# Altium schematic sheet Sheet1.SchDoc
size A3
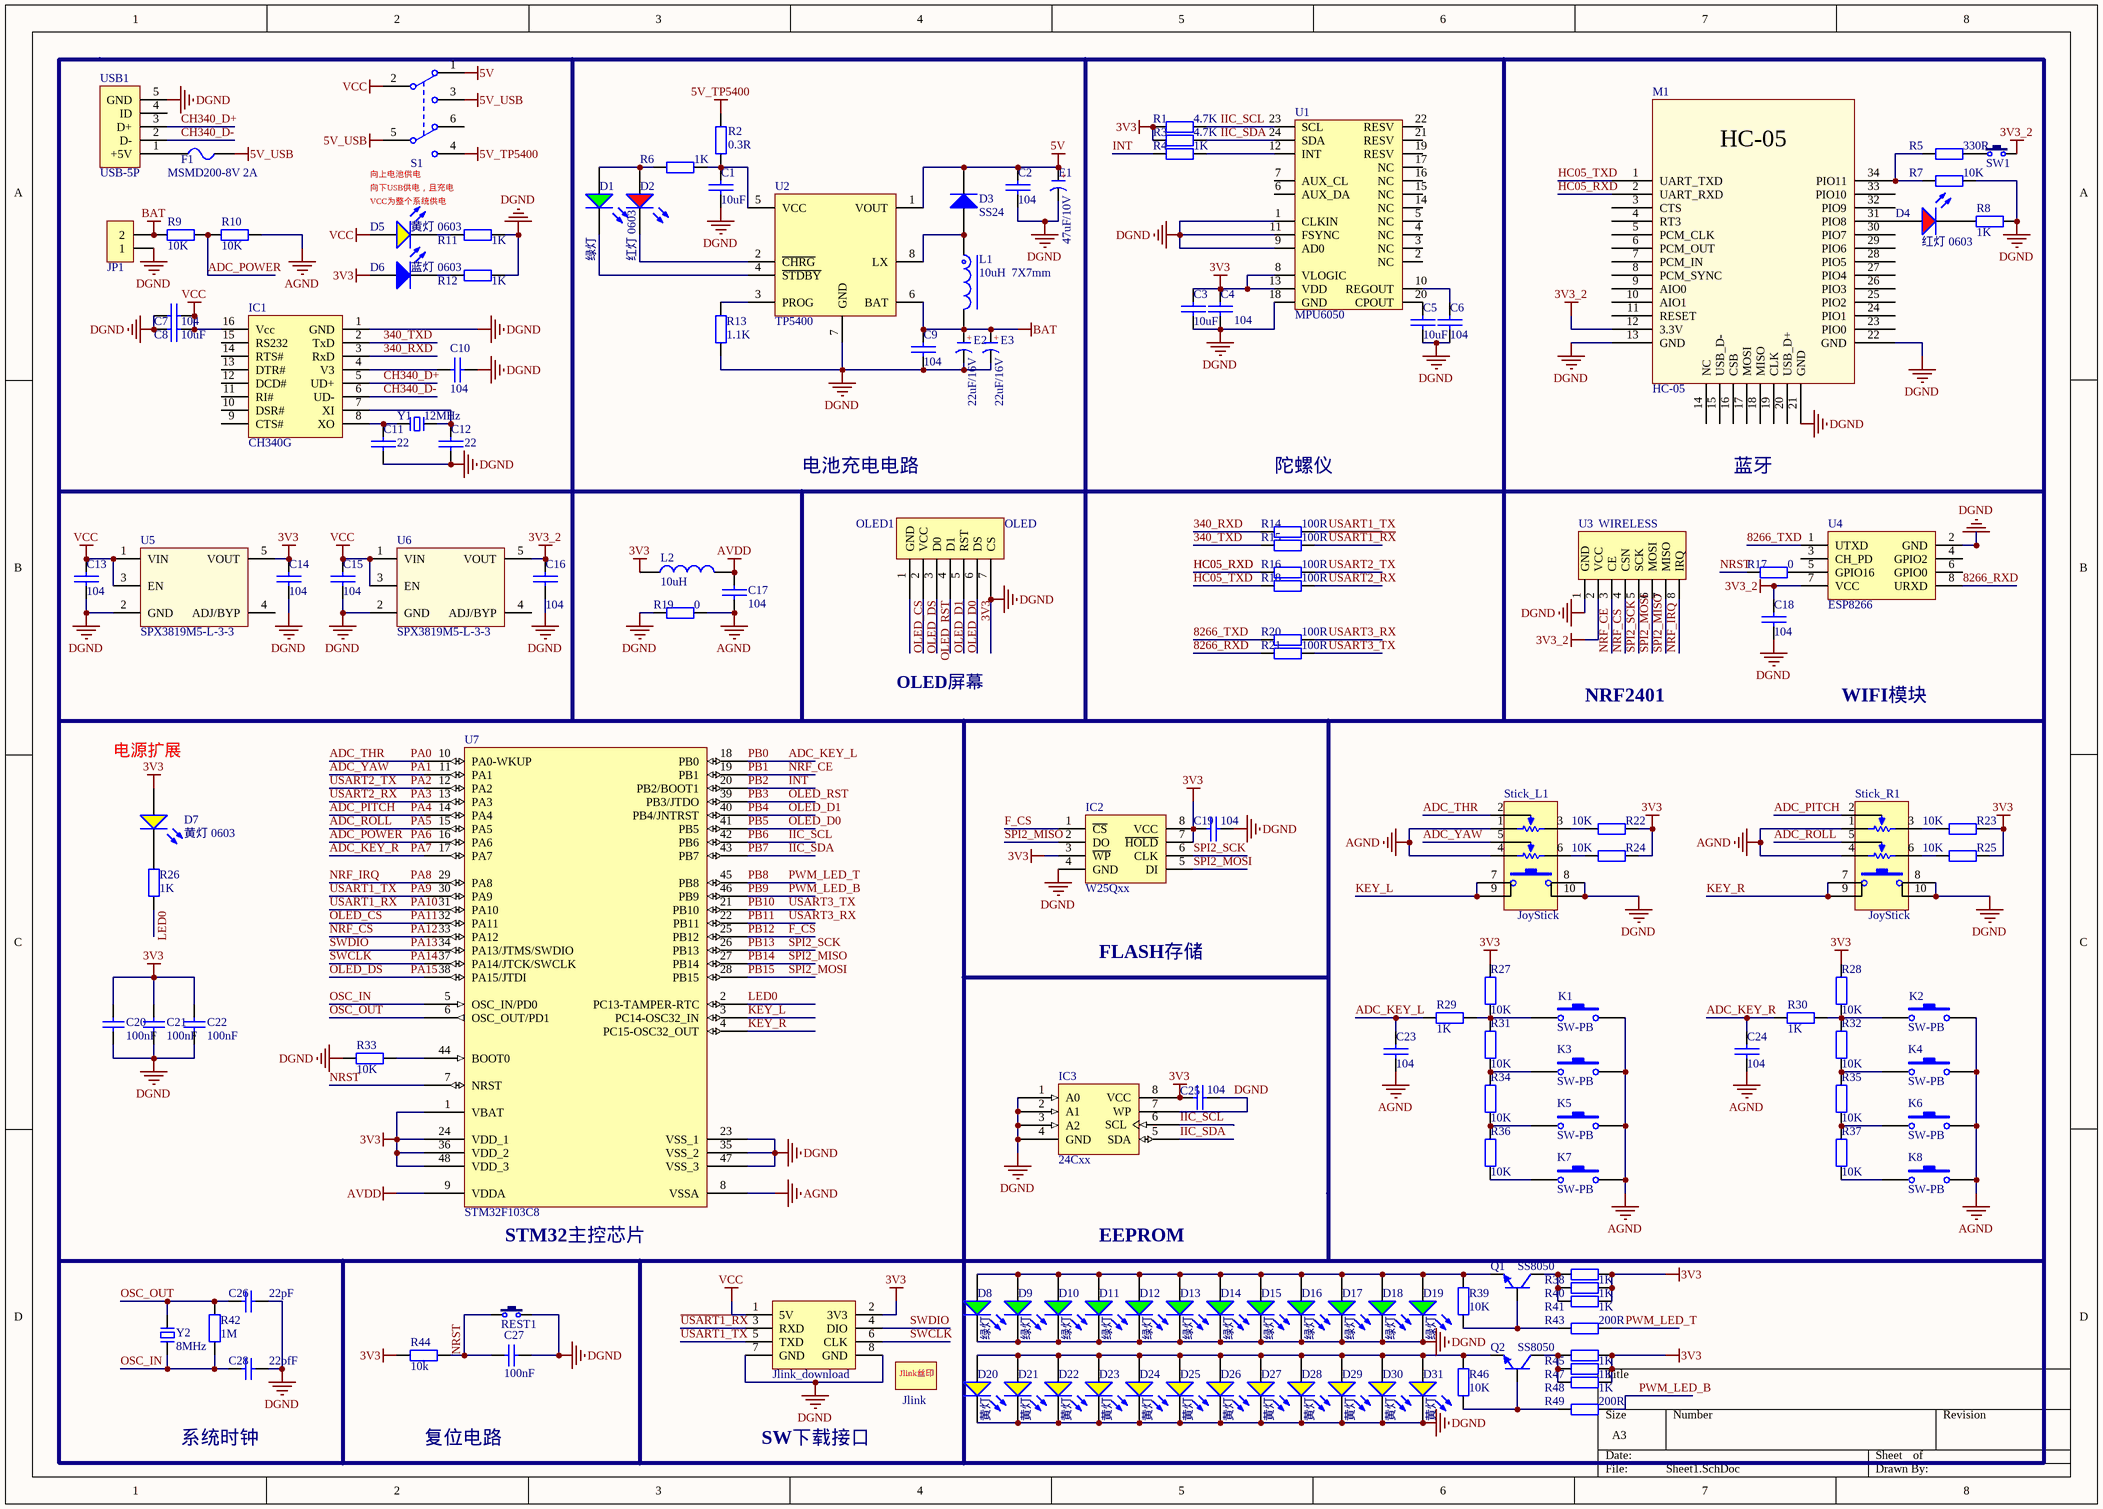
[diagram p0: Sheet1.SchDoc]

## Parts
*1  Jlink_download  [HDR2.54-M-LI-2x4P]
*2  Jlink  [Jlink_Load]
C1  10uF  [LC-0805_C]
C2  104  [LC-0603_C]
C3  10uF  [LC-0805_C]
C4  104  [LC-0603_C]
C5  10uF  [LC-0805_C]
C6  104  [LC-0603_C]
C7  104  [LC-0603_C]
C8  10uF  [LC-0805_C]
C9  104  [LC-0603_C]
C10  104  [LC-0603_C]
C11  22  [LC-0603_C]
C12  22  [LC-0603_C]
C13  104  [LC-0603_C]
C14  104  [LC-0603_C]
C15  104  [LC-0603_C]
C16  104  [LC-0603_C]
C17  104  [LC-0603_C]
C18  104  [LC-0603_C]
C19  104  [LC-0603_C]
C20  100nF  [LC-0603_C]
C21  100nF  [LC-0603_C]
C22  100nF  [LC-0603_C]
C23  104  [LC-0603_C]
C24  104  [LC-0603_C]
C25  104  [LC-0603_C]
C26  22pF  [LC-0603_C]
C27  100nF  [LC-0603_C]
C28  22pfF  [LC-0603_C]
D1  绿灯  [LC-0603_LED_S1]
D2  红灯 0603  [LC-0603_LED_S1]
D3  SS24  [SMB]
D4  红灯 0603  [LC-0603_LED_S1]
D5  黄灯 0603  [LC-0603_LED_S1]
D6  蓝灯 0603  [LC-0603_LED_S1]
D7  黄灯 0603  [LC-0603_LED_S1]
D8  绿灯  [LC-0603_LED_S1]
D9  绿灯  [LC-0603_LED_S1]
D10  绿灯  [LC-0603_LED_S1]
D11  绿灯  [LC-0603_LED_S1]
D12  绿灯  [LC-0603_LED_S1]
D13  绿灯  [LC-0603_LED_S1]
D14  绿灯  [LC-0603_LED_S1]
D15  绿灯  [LC-0603_LED_S1]
D16  绿灯  [LC-0603_LED_S1]
D17  绿灯  [LC-0603_LED_S1]
D18  绿灯  [LC-0603_LED_S1]
D19  绿灯  [LC-0603_LED_S1]
D20  黄灯  [LC-0603_LED_S1]
D21  黄灯  [LC-0603_LED_S1]
D22  黄灯  [LC-0603_LED_S1]
D23  黄灯  [LC-0603_LED_S1]
D24  黄灯  [LC-0603_LED_S1]
D25  黄灯  [LC-0603_LED_S1]
D26  黄灯  [LC-0603_LED_S1]
D27  黄灯  [LC-0603_LED_S1]
D28  黄灯  [LC-0603_LED_S1]
D29  黄灯  [LC-0603_LED_S1]
D30  黄灯  [LC-0603_LED_S1]
D31  黄灯  [LC-0603_LED_S1]
E1  47uF/10V  [CD B(3528)]
E2  22uF/16V  [CD B(3528)]
E3  22uF/16V  [CD B(3528)]
F1  MSMD200-8V 2A  [FU 0805]
IC1  CH340G  [SOP16_M]
IC2  W25Qxx  [SOP8W_M]
IC3  24Cxx  [SOP8_M]
JP1  HDR-1X2  [XH2.54-WI-2P]  (value not drawn)
K1  SW-PB  [TSW DIP-6*6*5]
K2  SW-PB  [TSW DIP-6*6*5]
K3  SW-PB  [TSW DIP-6*6*5]
K4  SW-PB  [TSW DIP-6*6*5]
K5  SW-PB  [TSW DIP-6*6*5]
K6  SW-PB  [TSW DIP-6*6*5]
K7  SW-PB  [TSW DIP-6*6*5]
K8  SW-PB  [TSW DIP-6*6*5]
L1  10uH  7X7mm  [CD75]
L2  10uH  [L 0603]
M1  HC-05  [HC-05]
OLED1  OLED  [OLED_096]
Q1  SS8050  [SOT23-3L]
Q2  SS8050  [SOT23-3L]
R1  4.7K  [LC-0603_R]
R2  0.3R  [R 2010_M]
R3  4.7K  [LC-0603_R]
R4  1K  [LC-0603_R]
R5  330R  [LC-0603_R]
R6  1K  [LC-0603_R]
R7  10K  [LC-0603_R]
R8  1K  [LC-0603_R]
R9  10K  [LC-0603_R]
R10  10K  [LC-0603_R]
R11  1K  [LC-0603_R]
R12  1K  [LC-0603_R]
R13  1.1K  [LC-0603_R]
R14  100R  [LC-0603_R]
R15  100R  [LC-0603_R]
R16  100R  [LC-0603_R]
R17  0  [LC-0603_R]
R18  100R  [LC-0603_R]
R19  0  [LC-0603_R]
R20  100R  [LC-0603_R]
R21  100R  [LC-0603_R]
R22  10K  [LC-0603_R]
R23  10K  [LC-0603_R]
R24  10K  [LC-0603_R]
R25  10K  [LC-0603_R]
R26  1K  [LC-0603_R]
R27  10K  [LC-0603_R]
R28  10K  [LC-0603_R]
R29  1K  [LC-0603_R]
R30  1K  [LC-0603_R]
R31  10K  [LC-0603_R]
R32  10K  [LC-0603_R]
R33  10K  [LC-0603_R]
R34  10K  [LC-0603_R]
R35  10K  [LC-0603_R]
R36  10K  [LC-0603_R]
R37  10K  [LC-0603_R]
R38  1K  [LC-0603_R]
R39  10K  [LC-0603_R]
R40  1K  [LC-0603_R]
R41  1K  [LC-0603_R]
R42  1M  [LC-0603_R]
R43  200R  [LC-0603_R]
R44  10k  [LC-0603_R]
R45  1K  [LC-0603_R]
R46  10K  [LC-0603_R]
R47  1K  [LC-0603_R]
R48  1K  [LC-0603_R]
R49  200R  [LC-0603_R]
REST1  3x6x5  [TSW SMD-3*6*2.5]  (value not drawn)
S1  SK-22D02  [SS-22H07-G2]  (value not drawn)
Stick_L1  JoyStick  [Stick]
Stick_R1  JoyStick  [Stick]
SW1  3x6x5  [TSW SMD-3*6*2.5]  (value not drawn)
U1  MPU6050  [QFN24 4x4_M]
U2  TP5400  [SOP8_M]
U3  WIRELESS  [2*4HEADER]
U4  ESP8266  [2*4HEADER]
U5  SPX3819M5-L-3-3  [SOT23-5M]
U6  SPX3819M5-L-3-3  [SOT23-5M]
U7  STM32F103C8  [LQFP48 7X7_M]
USB1  USB-5P  [USB-MICRO_A]
Y1  12MHz  [OSC HC-49S]
Y2  8MHz  [OSC HC-49S]

## Nets
3V3: *1.2(3V3) C3.2 C4.2 C14.2 C19.2 C20.1 C21.1 C22.1 C25.2 D6.A D7.A IC2.3(~{WP}) IC2.7(~{HOLD}) IC2.8(VCC) IC3.8(VCC) L2.1 OLED1.6(DS) R1.2 R3.2 R22.2 R23.2 R24.2 R25.2 R27.1 R28.1 R38.1 R40.1 R41.1 R44.1 R45.1 R47.1 R48.1 U1.8(VLOGIC) U1.13(VDD) U5.5(VOUT) U7.1(VBAT) U7.24(VDD_1) U7.36(VDD_2) U7.48(VDD_3)
3V3_2: C16.2 C18.2 M1.12(3.3V) SW1.2 U3.2(VCC) U4.7(VCC) U6.5(VOUT)
5V: C2.2 D3.2(K) E1.1(A) S1.1 U2.1(VOUT)
5V_TP5400: R2.2 S1.4
5V_USB: F1.2 S1.3 S1.5
AGND: C17.1 C23.1 C24.1 K1.2 K2.2 K3.2 K4.2 K5.2 K6.2 K7.2 K8.2 R10.1 R19.1 Stick_L1.1(BOT) Stick_L1.4(BOT) Stick_R1.1(BOT) Stick_R1.4(BOT) U7.8(VSSA)
AVDD: C17.2 L2.2 U7.9(VDDA)
BAT: C9.2 E2.1(A) E3.1(A) JP1.2 L1.2 R9.2 U2.6(BAT)
DGND: *1.7(GND) *1.8(GND) C1.1 C2.1 C3.1 C4.1 C5.1 C6.2 C7.2 C8.2 C9.1 C10.1 C11.2 C12.2 C13.1 C14.1 C15.1 C16.1 C18.1 C19.1 C20.2 C21.2 C22.2 C25.1 C26.2 C27.2 C28.2 D8.K D9.K D10.K D11.K D12.K D13.K D14.K D15.K D16.K D17.K D18.K D19.K D20.K D21.K D22.K D23.K D24.K D25.K D26.K D27.K D28.K D29.K D30.K D31.K E1.2(K) E2.2(K) E3.2(K) IC1.1(GND) IC2.4(GND) IC3.1(A0) IC3.2(A1) IC3.3(A2) IC3.4(GND) IC3.7(WP) JP1.1 M1.13(GND) M1.21(GND) M1.22(GND) OLED1.7(CS) R7.2 R8.2 R11.1 R12.1 R13.2 R19.2 R33.2 REST1.2 Stick_L1.8 Stick_L1.10 Stick_R1.8 Stick_R1.10 U1.1(CLKIN) U1.9(AD0) U1.11(FSYNC) U1.18(GND) U2.7(GND) U3.1(GND) U4.2(GND) U5.2(GND) U6.2(GND) U7.23(VSS_1) U7.35(VSS_2) U7.47(VSS_3) USB1.5(GND)
VCC: *1.1(5V) C7.1 C8.1 C13.2 C15.2 D5.A IC1.16(Vcc) S1.2 U5.1(VIN) U5.3(EN) U6.1(VIN) U6.3(EN)
340_RXD: IC1.3(RxD) R14.2
340_TXD: IC1.2(TxD) R15.2
8266_RXD: R21.2 U4.8(URXD)
8266_TXD: R20.2 U4.1(UTXD)
~{USART1_RX}: *1.3(RXD) R15.1 U7.31(PA10)  [also labelled PA10]
ADC_KEY_L: C23.2 R29.1 U7.18(PB0)  [also labelled PB0]
ADC_KEY_R: C24.2 R30.1 U7.17(PA7)  [also labelled PA7]
ADC_PITCH: Stick_R1.2(TAP) U7.14(PA4)  [also labelled PA4]
ADC_POWER: R9.1 R10.2 U7.16(PA6)  [also labelled PA6]
ADC_ROLL: Stick_R1.5(TAP) U7.15(PA5)  [also labelled PA5]
ADC_THR: Stick_L1.2(TAP) U7.10(PA0-WKUP)  [also labelled PA0]
ADC_YAW: Stick_L1.5(TAP) U7.11(PA1)  [also labelled PA1]
CH340_D+: IC1.5(UD+) USB1.3(D+)
CH340_D-: IC1.6(UD-) USB1.2(D-)
F_CS: IC2.1(~{CS}) U7.25(PB12)  [also labelled PB12]
HC05_RXD: M1.2(UART_RXD) R16.2
HC05_TXD: M1.1(UART_TXD) R18.2
IIC_SCL: IC3.6(SCL) R1.1 U1.23(SCL) U7.42(PB6)  [also labelled PB6]
IIC_SDA: IC3.5(SDA) R3.1 U1.24(SDA) U7.43(PB7)  [also labelled PB7]
INT: R4.2 U7.20(PB2/BOOT1)  [also labelled PB2]
KEY_L: Stick_L1.7 Stick_L1.9 U7.3(PC14-OSC32_IN)
KEY_R: Stick_R1.7 Stick_R1.9 U7.4(PC15-OSC32_OUT)
LED0: R26.2 U7.2(PC13-TAMPER-RTC)
NRF_CE: U3.3(CE) U7.19(PB1)  [also labelled PB1]
NRF_CS: U3.4(CSN) U7.33(PA12)  [also labelled PA12]
NRF_IRQ: U3.8(IRQ) U7.29(PA8)  [also labelled PA8]
NRST: C27.1 R17.2 R44.2 REST1.1 U7.7(NRST)
OLED_CS: OLED1.1(GND) U7.32(PA11)  [also labelled PA11]
OLED_D0: OLED1.5(RST) U7.41(PB5)  [also labelled PB5]
OLED_D1: OLED1.4(D1) U7.40(PB4/JNTRST)  [also labelled PB4]
OLED_DS: OLED1.2(VCC) U7.38(PA15/JTDI)  [also labelled PA15]
OLED_RST: OLED1.3(D0) U7.39(PB3/JTDO)  [also labelled PB3]
OSC_IN: C28.1 R42.1 U7.5(OSC_IN/PD0) Y2.1
OSC_OUT: C26.1 R42.2 U7.6(OSC_OUT/PD1) Y2.2
PA2: R16.1 U7.12(PA2)  [also labelled USART2_TX]
PA3: R18.1 U7.13(PA3)  [also labelled USART2_RX]
PA9: *1.5(TXD) R14.1 U7.30(PA9)  [also labelled USART1_TX]
PA13: *1.4(DIO) U7.34(PA13/JTMS/SWDIO)  [also labelled SWDIO]
PA14: *1.6(CLK) U7.37(PA14/JTCK/SWCLK)  [also labelled SWCLK]
PB8: R43.1 U7.45(PB8)  [also labelled PWM_LED_T]
PB9: R49.1 U7.46(PB9)  [also labelled PWM_LED_B]
PB10: R21.1 U7.21(PB10)  [also labelled USART3_TX]
PB11: R20.1 U7.22(PB11)  [also labelled USART3_RX]
PB13: IC2.6(CLK) U3.5(SCK) U7.26(PB13)  [also labelled SPI2_SCK]
PB14: IC2.2(DO) U3.7(MISO) U7.27(PB14)  [also labelled SPI2_MISO]
PB15: IC2.5(DI) U3.6(MOSI) U7.28(PB15)  [also labelled SPI2_MOSI]
NetC1_2: C1.2 R2.1 R6.1 U2.5(VCC)
NetC5_2: C5.2 U1.20(CPOUT)
NetC6_1: C6.1 U1.10(REGOUT)
NetC10_2: C10.2 IC1.4(V3)
NetC11_1: C11.1 IC1.8(XO) Y1.2
NetC12_1: C12.1 IC1.7(XI) Y1.1
NetD1_A: D1.A D2.A R6.2
NetD1_K: D1.K U2.4(~{STDBY})
NetD2_K: D2.K U2.2(~{CHRG})
NetD3_1: D3.1(A) L1.1 U2.8(LX)
NetD4_A: D4.A M1.31(PIO8)
NetD4_K: D4.K R8.1
NetD5_K: D5.K R11.2
NetD6_K: D6.K R12.2
NetD7_K: D7.K R26.1
NetD8_A: D8.A D9.A D10.A D11.A D12.A D13.A D14.A D15.A D16.A D17.A D18.A D19.A Q1.2(E) R39.1
NetD20_A: D20.A D21.A D22.A D23.A D24.A D25.A D26.A D27.A D28.A D29.A D30.A D31.A Q2.2(E) R46.1
NetF1_1: F1.1 USB1.1(+5V)
NetK1_1: K1.1 R27.2 R29.2 R31.1
NetK2_1: K2.1 R28.2 R30.2 R32.1
NetK3_1: K3.1 R31.2 R34.1
NetK4_1: K4.1 R32.2 R35.1
NetK5_1: K5.1 R34.2 R36.1
NetK6_1: K6.1 R35.2 R37.1
NetK7_1: K7.1 R36.2
NetK8_1: K8.1 R37.2
NetM1_34: M1.34(PIO11) R5.1 R7.1
NetQ1_1: Q1.1(B) R39.2 R43.2
NetQ1_3: Q1.3(C) R38.2 R40.2 R41.2
NetQ2_1: Q2.1(B) R46.2 R49.2
NetQ2_3: Q2.3(C) R45.2 R47.2 R48.2
NetR4_1: R4.1 U1.12(INT)
NetR5_2: R5.2 SW1.1
NetR13_1: R13.1 U2.3(PROG)
NetR17_1: R17.1 U4.5(GPIO16)
NetR22_1: R22.1 Stick_L1.3(TOP)
NetR23_1: R23.1 Stick_R1.3(TOP)
NetR24_1: R24.1 Stick_L1.6(TOP)
NetR25_1: R25.1 Stick_R1.6(TOP)
NetR33_1: R33.1 U7.44(BOOT0)

Not connected (* = marked no-connect by the designer): IC1 9(CTS#) 10(DSR#) 11(RI#) 12(DCD#) 13(DTR#) 14(RTS#) 15(RS232); M1 3(CTS) 4(RT3) 5(PCM_CLK) 6(PCM_OUT) 7(PCM_IN) 8(PCM_SYNC) 9(AIO0) 10(AIO1) 11(RESET) 14(NC) 15(USB_D-) 16(CSB) 17(MOSI) 18(MISO) 19(CLK) 20(USB_D+) 23(PIO0) 24(PIO1) 25(PIO2) 26(PIO3) 27(PIO4) 28(PIO5) 29(PIO6) 30(PIO7) 32(PIO9) 33(PIO10); S1 6; U1 2(NC) 3(NC) 4(NC) 5(NC) 6(AUX_DA) 7(AUX_CL) 14(NC) 15(NC) 16(NC) 17(NC) 19(RESV) 21(RESV) 22(RESV); U4 3(CH_PD) 4(GPIO2) 6(GPIO0); U5 4(ADJ/BYP); U6 4(ADJ/BYP); USB1 4(ID)

## Notes on the sheet
- (near S1) 向上电池供电
- 向下USB供电，且充电
- VCC为整个系统供电
- 电池充电电路
- 陀螺仪
- 蓝牙
- OLED屏幕
- NRF2401
- WIFI模块
- 电源扩展
- FLASH存储
- (near U7) STM32主控芯片
- EEPROM
- 系统时钟
- 复位电路
- SW下载接口
- (in symbol C-CD) +

## Library data of the parts
*1 = Jlink_下载器: Jlink下载器
*2 = Jlink: Jlink丝印
C1-C19 C23-C25 = 0805C: Capacitor 0805
C20-C22 C26-C28 = Cap: 无极性电容; Published: 8-Jun-2000; LatestRevisionDate: 17-Jul-2002; LatestRevisionNote: Re-released for DXP Platform.; PackageReference: RAD-0.3; Publisher: Altium Limited
D1 D8-D19 = 0603 绿灯: 发光二极管; ComponentLink1Description: 供应商链接; ComponentLink1URL: http://www.szlcsc.com/product/details_73152.html; Package: 0603; Supplier: LC; SuppliersPartNumber: C72043
D2 D4 = 0603 红灯: 发光二极管; ComponentLink1Description: 供应商链接; ComponentLink1URL: http://www.szlcsc.com/product/details_2659.html; Package: 0603; Supplier: LC; SuppliersPartNumber: C2286
D3 = Diode 1N4148: High Conductance Fast Diode; Published: 8-Jun-2000; LatestRevisionDate: 17-Jul-2002; LatestRevisionNote: Re-released for DXP Platform.; DatasheetDocument: 1997; PackageReference: DO-35; Publisher: Altium Limited; Code_JEDEC: DO-204-AH; ComponentLink1Description: Manufacturer Link; ComponentLink1URL: http://www.fairchildsemi.com/; ComponentLink2Description: Datasheet; ComponentLink2URL: http://www.fairchildsemi.com/ds/1N%2F1N4148.pdf
D5 D7 D20-D31 = 0603 黄灯: 发光二极管; ComponentLink1Description: 供应商链接; ComponentLink1URL: http://www.szlcsc.com/product/details_73147.html; Package: 0603; Supplier: LC; SuppliersPartNumber: C72038
D6 = 0603 蓝灯: 发光二极管; ComponentLink1Description: 供应商链接; ComponentLink1URL: http://www.szlcsc.com/product/details_73150.html; Package: 0603; Supplier: LC; SuppliersPartNumber: C72041
E1-E3 = C-CD: 贴片钽电容; 版权归属: 源创客; BOM名称: 贴片钽电容; 学习资源: www.ooocke.com
F1 = FU: 贴片保险丝; 版权归属: 源创客; BOM名称: 贴片保险丝; 学习资源: www.ooocke.com
IC1 = CH340G: 串口转USB; 版权归属: 源创客; BOM名称: 串口转USB; 学习资源: www.ooocke.com
IC2 = W25Qxx: 外置Flash; 版权归属: 源创客; BOM名称: 外置Flash; 学习资源: www.ooocke.com
IC3 = 24Cxx: 外置EEPROM; 版权归属: 源创客; BOM名称: 外置EEPROM; 学习资源: www.ooocke.com
JP1 = Header 2: 2P接插件; 版权归属: 源创客; BOM名称: 2P接插件; 学习资源: www.ooocke.com
K1-K8 = SW-PB: Switch; Published: 24-Mar-1999; LatestRevisionDate: 17-Jul-2002; LatestRevisionNote: Re-released for DXP Platform.; PackageReference: SPST-2; Publisher: Altium Limited; PackageDescription: Switch; 2 Leads
L1 = L-CD: 贴片功率电感; BOM名称: 功率电感; 版权归属: 源创客; 学习资源: www.ooocke.com
L2 = L: 小功率贴片电感; 版权归属: 源创客; BOM名称: 小功率贴片电感; 学习资源: www.ooocke.com
M1 = HC-05: 串口蓝牙模块; 版权归属: 源创客; BOM名称: 串口蓝牙模块; 学习资源: www.ooocke.com
OLED1 = OLED_SPI: OLED屏幕
Q1 Q2 = 8050-SMD: 高频放大-NPN型; 版权归属: 源创客; 属性: 40V 1.5A 1W 100MHZ; BOM名称: 高频放大-NPN型; 学习资源: www.ooocke.com
R1 R3 R5 R7 R9 R10 R13-R25 R27 R28 R31-R37 R39 R42-R44 R46 R49 = Res1: 贴片电阻; Value: 1K; Published: 8-Jun-2000; LatestRevisionDate: 17-Jul-2002; LatestRevisionNote: Re-released for DXP Platform.; PackageReference: AXIAL-0.4; Publisher: Altium Limited
R2 = R: 贴片电阻; 版权归属: 源创客; BOM名称: 贴片电阻; 学习资源: www.ooocke.com
R4 R6 R8 R11 R12 R26 R29 R30 R38 R40 R41 R45 R47 R48 = Res1: 贴片电阻; Published: 8-Jun-2000; LatestRevisionDate: 17-Jul-2002; LatestRevisionNote: Re-released for DXP Platform.; PackageReference: AXIAL-0.4; Publisher: Altium Limited; Value: 1K
REST1 SW1 = TSW 3x6: 3x6轻触开关; 版权归属: 源创客; BOM名称: 3x6轻触开关; 学习资源: www.ooocke.com
S1 = SSW-2P: 2路波动开关; BOM名称: 波动开关; 版权归属: 源创客; 学习资源: www.ooocke.com
Stick_L1 Stick_R1 = JoyStick: 模拟摇杆
U1 = MPU6050: 9轴运动处理传感器
U2 = TP5400: 锂电池充电芯片
U3 = NRF24L01
U4 = ESP8266: WIFI通信模块
U7 = STM32F103C8: Flaah:64/RAM:20/IO:36; BOM名称: 32位STM单片机; 版权归属: 源创客; 学习资源: www.ooocke.com
USB1 = USB-5P: 微型USB母座; 版权归属: 源创客; BOM名称: 微型USB母座; 学习资源: www.ooocke.com
Y1 Y2 = XTAL-2P: 2脚无源脚晶振; 版权归属: 源创客; BOM名称: 2脚无源脚晶振; 学习资源: www.ooocke.com